# EAGLE schematic v1.7 (EAGLE 9.6.2)
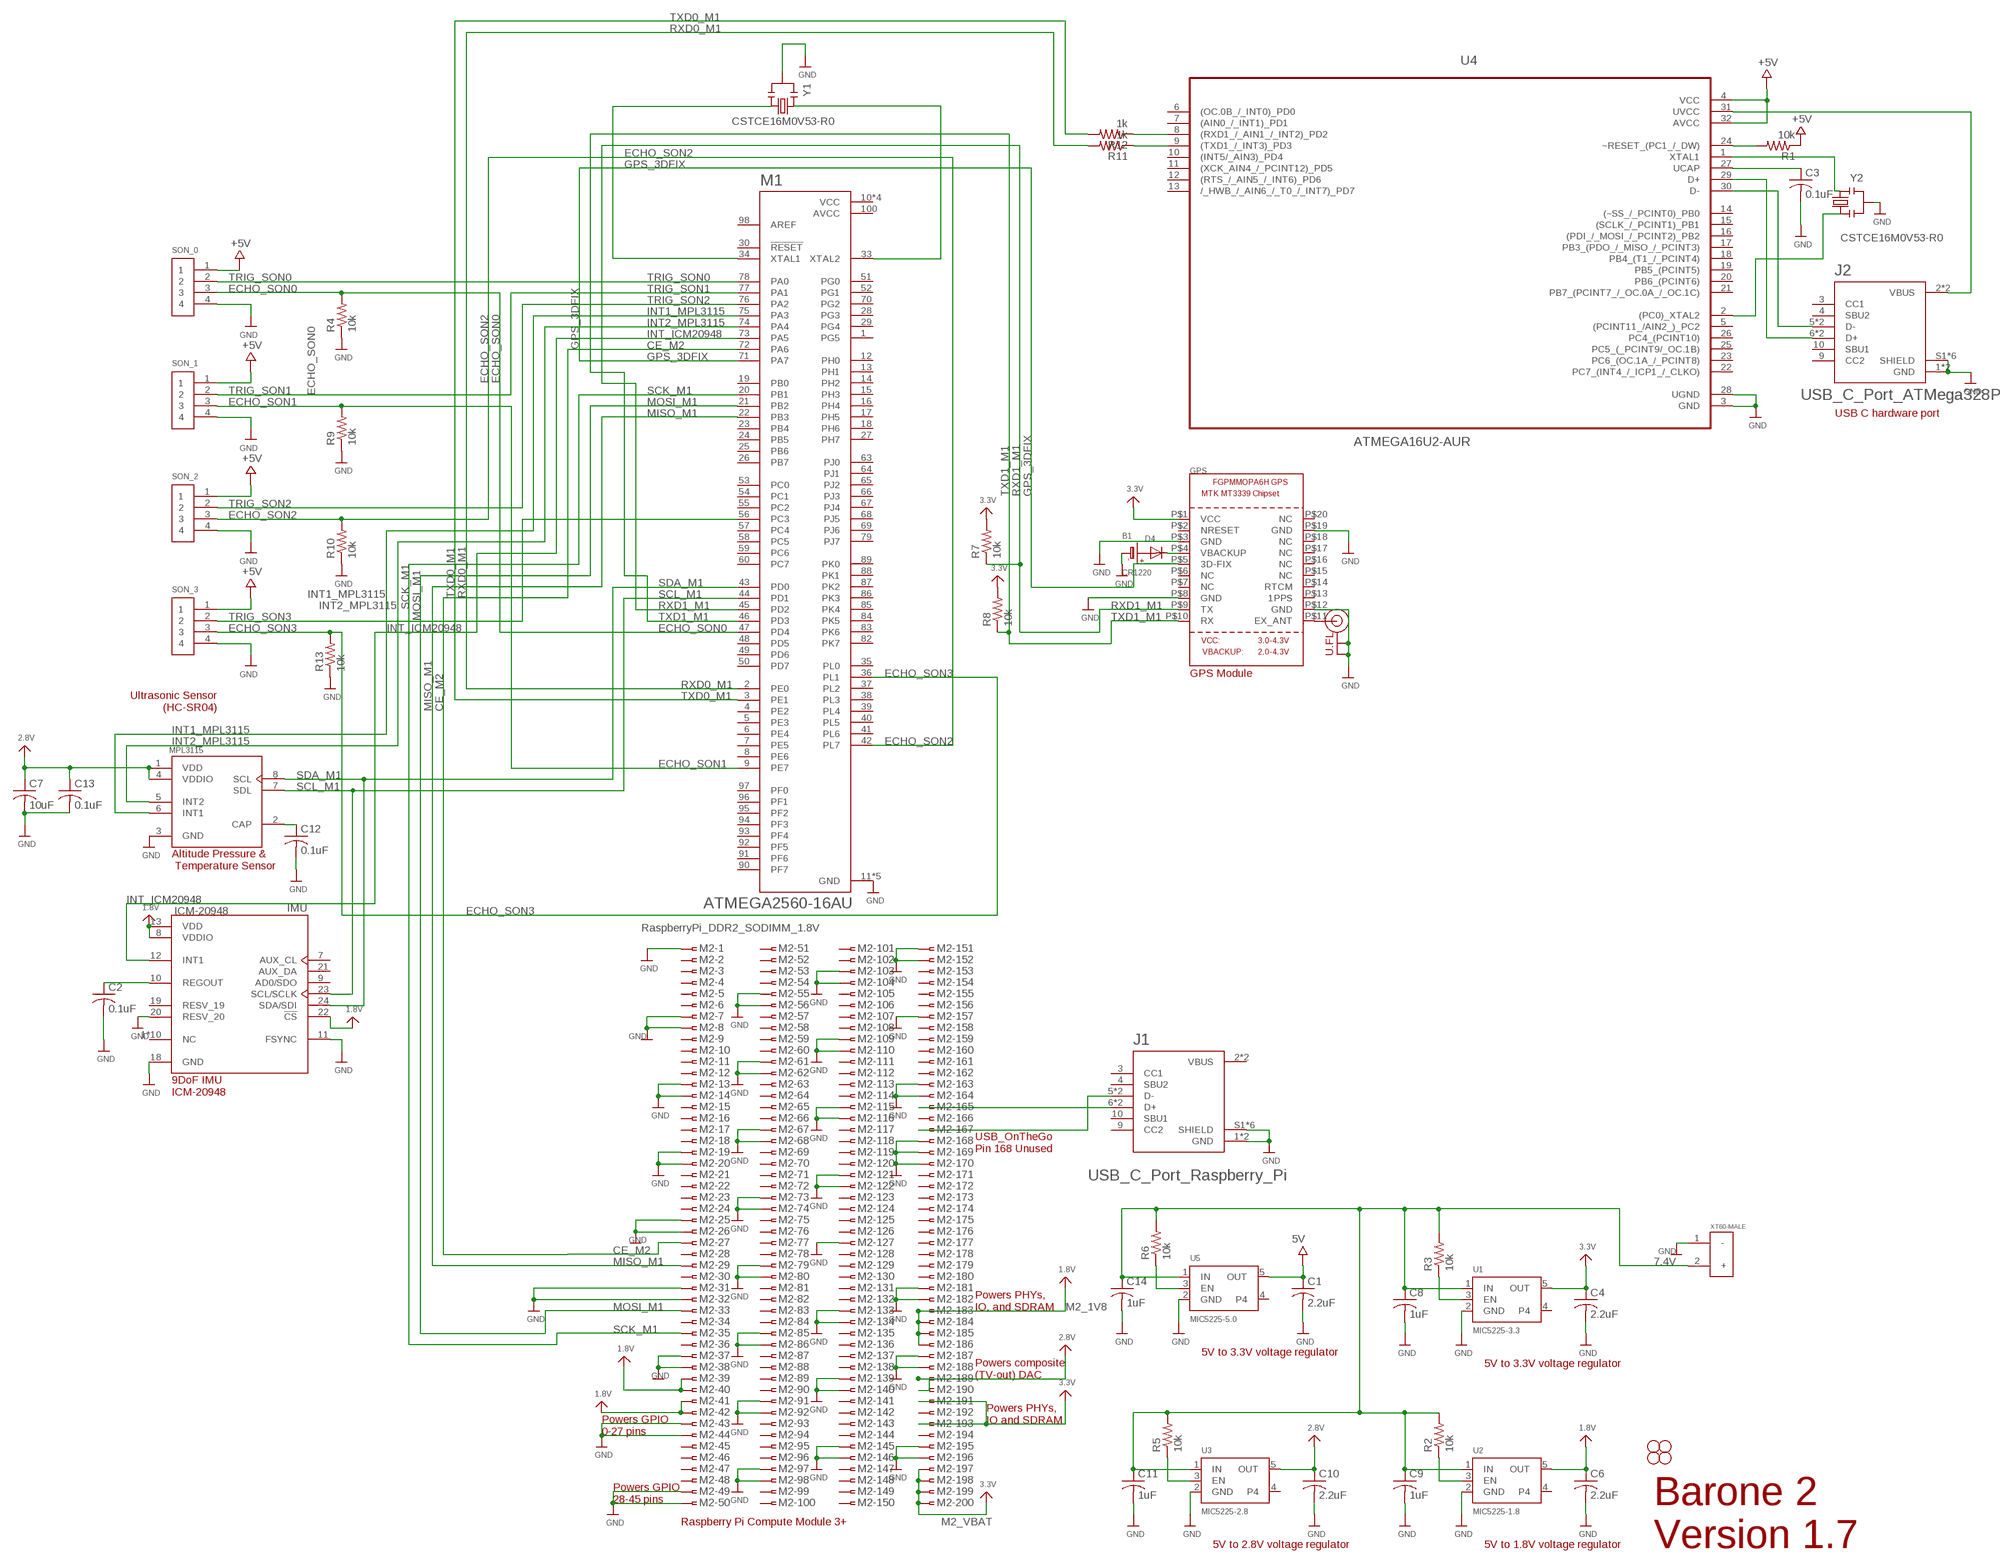
[diagram p0: schematic, sheet 1]

## Parts
B1  CR1220  BATTERYCR1220_SMT  [CR1220]
C1  2.2uF  C-USC0805  [C0805]
C2  0.1uF  C-USC0805  [C0805]
C3  0.1uF  C-USC0805  [C0805]
C4  2.2uF  C-USC0805  [C0805]
C6  2.2uF  C-USC0805  [C0805]
C7  10uF  C-USC0805  [C0805]
C8  1uF  C-USC0805  [C0805]
C9  1uF  C-USC0805  [C0805]
C10  2.2uF  C-USC0805  [C0805]
C11  1uF  C-USC0805  [C0805]
C12  0.1uF  C-USC0805  [C0805]
C13  0.1uF  C-USC0805  [C0805]
C14  1uF  C-USC0805  [C0805]
D4  DIODESOD-323F  [SOD-323F]
GPS  GPS_FGPMMOPA6H  [FGPMMOPA6H]
H1  STAND-OFF  [STAND-OFF]
H2  STAND-OFF  [STAND-OFF]
H3  STAND-OFF  [STAND-OFF]
H4  STAND-OFF  [STAND-OFF]
IMU  ICM-20948  [QFN40P300X300X105-24N]
J1  USB_C_Port_Raspberry_Pi  DX07S016JA1R1500  [JAE_DX07S016JA1R1500]
J2  USB_C_Port_ATMega328P  DX07S016JA1R1500  [JAE_DX07S016JA1R1500]
M1  ATMEGA2560-16AU  [QFP50P1600X1600X120-100N]
M2  RaspberryPi_DDR2_SODIMM_1.8V  1376408-SLOT_1.8V  [SLOT-1376408-1_1.8V]
MPL3115  MPL3115A2  [PSON125P300X500X120-8N]
R1  10k  R-US_R0805W  [R0805W]
R2  10k  R-US_R0805W  [R0805W]
R3  10k  R-US_R0805W  [R0805W]
R4  10k  R-US_R0805W  [R0805W]
R5  10k  R-US_R0805W  [R0805W]
R6  10k  R-US_R0805W  [R0805W]
R7  10k  R-US_R0805W  [R0805W]
R8  10k  R-US_R0805W  [R0805W]
R9  10k  R-US_R0805W  [R0805W]
R10  10k  R-US_R0805W  [R0805W]
R11  1k  R-US_R0805W  [R0805W]
R12  1k  R-US_R0805W  [R0805W]
R13  10k  R-US_R0805W  [R0805W]
SON_0  1X4-BIG  [1X04-BIG]
SON_1  1X4-BIG  [1X04-BIG]
SON_2  1X4-BIG  [1X04-BIG]
SON_3  1X4-BIG  [1X04-BIG]
U1  MIC5225-3.3  VREG_SOT23-5  [SOT23-5]
U2  MIC5225-1.8  VREG_SOT23-5  [SOT23-5]
U3  MIC5225-2.8  VREG_SOT23-5  [SOT23-5]
U4  ATMEGA16U2-AUR  [QFP80P900X900X120-32N]
U5  MIC5225-5.0  VREG_SOT23-5  [SOT23-5]
U.FL  U.FL  [U.FL]
XT60-MALE  XT60-M  [AMASS_XT60-M]
Y1  CSTCE16M0V53-R0  0011_CSTCE16M0V53-R0  [RESONATOR]
Y2  CSTCE16M0V53-R0  0011_CSTCE16M0V53-R0  [RESONATOR]

## Nets
7.4V: C8.1 C9.1 C11.1 C14.1 R2.2 R3.2 R5.2 R6.2 U1.1(IN) U2.1(IN) U3.1(IN) U5.1(IN) XT60-MALE.2(+)
+5V: R1.1 SON_0.1 SON_1.1 SON_2.1 SON_3.1 U4.4(VCC) U4.32(AVCC)
CE_M2: M1.72(PA6) M2.27
ECHO_SON0: M1.47(PD4) R4.2 SON_0.3
ECHO_SON1: M1.9(PE7) R9.2 SON_1.3
ECHO_SON2: M1.42(PL7) R10.2 SON_2.3
ECHO_SON3: M1.36(PL1) R13.2 SON_3.3
GND: B1.- C1.2 C2.2 C3.2 C4.2 C6.2 C7.2 C8.2 C9.2 C10.2 C11.2 C12.2 C13.2 C14.2 GPS.P$3(GND) GPS.P$8(GND) GPS.P$19(GND) IMU.11(FSYNC) IMU.18(GND) IMU.20(RESV_20) J1.1(GND) J1.12(GND) J1.S1(SHIELD) J1.S2(SHIELD) J1.S3(SHIELD) J1.S4(SHIELD) J1.S5(SHIELD) J1.S6(SHIELD) J2.1(GND) J2.12(GND) J2.S1(SHIELD) J2.S2(SHIELD) J2.S3(SHIELD) J2.S4(SHIELD) J2.S5(SHIELD) J2.S6(SHIELD) M1.11(GND) M1.32(GND) M1.62(GND) M1.81(GND) M1.99(GND) M2.1 M2.7 M2.8 M2.13 M2.14 M2.19 M2.20 M2.25 M2.26 M2.31 M2.32 M2.37 M2.38 M2.43 M2.44 M2.49 M2.50 M2.55 M2.56 M2.61 M2.62 M2.67 M2.68 M2.73 M2.74 M2.79 M2.80 M2.85 M2.86 M2.91 M2.92 M2.97 M2.98 M2.103 M2.104 M2.109 M2.110 M2.115 M2.116 M2.121 M2.122 M2.127 M2.133 M2.134 M2.139 M2.140 M2.145 M2.146 M2.151 M2.152 M2.157 M2.163 M2.164 M2.168 M2.169 M2.170 M2.181 M2.182 M2.187 M2.188 M2.195 M2.196 MPL3115.3(GND) R4.1 R9.1 R10.1 R13.1 SON_0.4 SON_1.4 SON_2.4 SON_3.4 U1.2(GND) U2.2(GND) U3.2(GND) U4.3(GND) U4.28(UGND) U5.2(GND) XT60-MALE.1(-) Y1.2 Y2.2
GPS_3DFIX: GPS.P$5(3D-FIX) M1.71(PA7)
INT1_MPL3115: M1.75(PA3) MPL3115.6(INT1)
INT2_MPL3115: M1.74(PA4) MPL3115.5(INT2)
INT_ICM20948: IMU.12(INT1) M1.73(PA5)
M2_1V8: M2.183 M2.184 M2.185 M2.186 ; supply symbol labelled 1.8V
M2_VBAT: M2.197 M2.198 M2.199 M2.200 ; supply symbol labelled 3.3V
MISO_M1: M1.22(PB3) M2.29
MOSI_M1: M1.21(PB2) M2.33
N$1: M1.34(XTAL1) Y1.3
N$2: GPS.P$12(GND) U.FL.P$1(GND) U.FL.P$2(GND) ; supply symbol labelled GND
N$3: GPS.P$11(EX_ANT) U.FL.P$3(SIGNAL)
N$4: R3.1 U1.3(EN)
N$5: B1.+$1(+) B1.+$2(+) D4.A
N$6: R2.1 U2.3(EN)
N$7: J1.6(D+) J1.7(D+) M2.165
N$8: J1.5(D-) J1.8(D-) M2.167
N$9: M2.39 M2.40 ; supply symbol labelled 1.8V
N$10: C12.1 MPL3115.2(CAP)
N$11: R6.1 U5.3(EN)
N$12: R5.1 U3.3(EN)
N$13: M1.33(XTAL2) Y1.1
N$14: U4.1(XTAL1) Y2.1
N$15: M2.41 M2.42 ; supply symbol labelled 1.8V
N$17: U4.2((PC0)_XTAL2) Y2.3
N$18: J2.5(D-) J2.8(D-) U4.30(D-)
N$21: D4.C GPS.P$4(VBACKUP)
N$22: J2.6(D+) J2.7(D+) U4.29(D+)
N$23: J2.2(VBUS) J2.11(VBUS) U4.31(UVCC)
N$24: R11.1 U4.9((TXD1_/_INT3)_PD3)
N$25: R12.1 U4.8((RXD1_/_AIN1_/_INT2)_PD2)
N$26: R1.2 U4.24(~RESET_(PC1_/_DW))
N$27: C3.1 U4.27(UCAP)
N$32: C2.1 IMU.10(REGOUT)
OUT: C1.1 C4.1 C6.1 C10.1 U1.5(OUT) U2.5(OUT) U3.5(OUT) U5.5(OUT) ; supply symbol labelled 3.3V, 1.8V, 2.8V, 5V
RXD0_M1: M1.2(PE0) R11.2
RXD1_M1: GPS.P$9(TX) M1.45(PD2) R7.1
SCK_M1: M1.20(PB1) M2.35
SCL_M1: IMU.23(SCL/SCLK) M1.44(PD1) MPL3115.7(SDL)
SDA_M1: IMU.24(SDA/SDI) M1.43(PD0) MPL3115.8(SCL)
TRIG_SON0: M1.78(PA0) SON_0.2
TRIG_SON1: M1.77(PA1) SON_1.2
TRIG_SON2: M1.76(PA2) SON_2.2
TRIG_SON3: M1.56(PC3) SON_3.2
TXD0_M1: M1.3(PE1) R12.2
TXD1_M1: GPS.P$10(RX) M1.46(PD3) R8.1
VIN: C7.1 C13.1 GPS.P$1(VCC) IMU.8(VDDIO) IMU.13(VDD) IMU.22(!CS) M2.189 M2.190 M2.191 M2.193 MPL3115.1(VDD) MPL3115.4(VDDIO) R7.2 R8.2 ; supply symbol labelled 2.8V, 3.3V, 1.8V
Unconnected: GPS.P$2(NRESET) GPS.P$6(NC) GPS.P$7(NC) GPS.P$13(1PPS) GPS.P$14(RTCM) GPS.P$15(NC) GPS.P$16(NC) GPS.P$17(NC) GPS.P$18(NC) GPS.P$20(NC) IMU.1(NC) IMU.2(NC) IMU.3(NC) IMU.4(NC) IMU.5(NC) IMU.6(NC) IMU.7(AUX_CL) IMU.9(AD0/SDO) IMU.14(NC) IMU.15(NC) IMU.16(NC) IMU.17(NC) IMU.19(RESV_19) IMU.21(AUX_DA) J1.3(CC1) J1.4(SBU2) J1.9(CC2) J1.10(SBU1) J2.3(CC1) J2.4(SBU2) J2.9(CC2) J2.10(SBU1) M1.1(PG5) M1.4(PE2) M1.5(PE3) M1.6(PE4) M1.7(PE5) M1.8(PE6) M1.12(PH0) M1.13(PH1) M1.14(PH2) M1.15(PH3) M1.16(PH4) M1.17(PH5) M1.18(PH6) M1.19(PB0) M1.23(PB4) M1.24(PB5) M1.25(PB6) M1.26(PB7) M1.27(PH7) M1.28(PG3) M1.29(PG4) M1.30(!RESET) M1.35(PL0) M1.37(PL2) M1.38(PL3) M1.39(PL4) M1.40(PL5) M1.41(PL6) M1.48(PD5) M1.49(PD6) M1.50(PD7) M1.51(PG0) M1.52(PG1) M1.53(PC0) M1.54(PC1) M1.55(PC2) M1.57(PC4) M1.58(PC5) M1.59(PC6) M1.60(PC7) M1.63(PJ0) M1.64(PJ1) M1.65(PJ2) M1.66(PJ3) M1.67(PJ4) M1.68(PJ5) M1.69(PJ6) M1.70(PG2) M1.79(PJ7) M1.82(PK7) M1.83(PK6) M1.84(PK5) M1.85(PK4) M1.86(PK3) M1.87(PK2) M1.88(PK1) M1.89(PK0) M1.90(PF7) M1.91(PF6) M1.92(PF5) M1.93(PF4) M1.94(PF3) M1.95(PF2) M1.96(PF1) M1.97(PF0) M1.98(AREF) M2.2 M2.3 M2.4 M2.5 M2.6 M2.9 M2.10 M2.11 M2.12 M2.15 M2.16 M2.17 M2.18 M2.21 M2.22 M2.23 M2.24 M2.28 M2.30 M2.34 M2.36 M2.45 M2.46 M2.47 M2.48 M2.51 M2.52 M2.53 M2.54 M2.57 M2.58 M2.59 M2.60 M2.63 M2.64 M2.65 M2.66 M2.69 M2.70 M2.71 M2.72 M2.75 M2.76 M2.77 M2.78 M2.81 M2.82 M2.83 M2.84 M2.87 M2.88 M2.89 M2.90 M2.93 M2.94 M2.95 M2.96 M2.99 M2.100 M2.101 M2.102 M2.105 M2.106 M2.107 M2.108 M2.111 M2.112 M2.113 M2.114 M2.117 M2.118 M2.119 M2.120 M2.123 M2.124 M2.125 M2.126 M2.128 M2.129 M2.130 M2.131 M2.132 M2.135 M2.136 M2.137 M2.138 M2.141 M2.142 M2.143 M2.144 M2.147 M2.148 M2.149 M2.150 M2.153 M2.154 M2.155 M2.156 M2.158 M2.159 M2.160 M2.161 M2.162 M2.166 M2.171 M2.172 M2.173 M2.174 M2.175 M2.176 M2.177 M2.178 M2.179 M2.180 M2.192 M2.194 U1.4 U2.4 U3.4 U4.5((PCINT11_/AIN2_)_PC2) U4.6((OC.0B_/_INT0)_PD0) U4.7((AIN0_/_INT1)_PD1) U4.10((INT5/_AIN3)_PD4) U4.11((XCK_AIN4_/_PCINT12)_PD5) U4.12((RTS_/_AIN5_/_INT6)_PD6) U4.13(/_HWB_/_AIN6_/_T0_/_INT7)_PD7) U4.14((~SS_/_PCINT0)_PB0) U4.15((SCLK_/_PCINT1)_PB1) U4.16((PDI_/_MOSI_/_PCINT2)_PB2) U4.17(PB3_(PDO_/_MISO_/_PCINT3)) U4.18(PB4_(T1_/_PCINT4)) U4.19(PB5_(PCINT5)) U4.20(PB6_(PCINT6)) U4.21(PB7_(PCINT7_/_OC.0A_/_OC.1C)) U4.22(PC7_(INT4_/_ICP1_/_CLKO)) U4.23(PC6_(OC.1A_/_PCINT8)) U4.25(PC5_(_PCINT9/_OC.1B)) U4.26(PC4_(PCINT10)) U5.4

## Notes on the sheet
- USB C hardware port
- U.FL
- GPS Module
- Ultrasonic Sensor
  (HC-SR04)
- Altitude Pressure &
   Temperature Sensor
- 9DoF IMU
  ICM-20948
- USB_OnTheGo
  Pin 168 Unused
- Powers PHYs, 
  IO, and SDRAM
- 5V to 3.3V voltage regulator
- 5V to 3.3V voltage regulator
- Powers composite
  (TV-out) DAC
- Powers PHYs, 
  IO and SDRAM
- Powers GPIO 
  0-27 pins
- Powers GPIO 
  28-45 pins
- Raspberry Pi Compute Module 3+
- 5V to 2.8V voltage regulator | 5V to 1.8V voltage regulator
- Barone 2
  Version 1.7

## Power pins joined to a net without a drawn wire
AVCC: M1.100(AVCC)
VBUS: J1.2(VBUS) J1.11(VBUS)
VCC: M1.10(VCC) M1.31(VCC) M1.61(VCC) M1.80(VCC)

## Library data of the parts
B1 = microbuilder:BATTERY: CR1220 SMT - Digikey: 3001K-ND CD2032 BAT-HLD-001 - Digikey: BAT-HLD-001-ND
C1-C4 C6-C14 = rcl:C-US: CAPACITOR, American symbol; SPICEPREFIX: C
D4 = adafruit:DIODE: Diode SMADIODE - SMA Surface Mount Package 20V 1A Schottky Diode Digikey: 641-1014-6-ND DO-1N4148 - Through Hole Small Current Diode SOD-123 20V 1 A (.5mV Vf) Schottky Diode - Digikey: MBRX120TPMSCT-ND SOD-323 10V 570mA (.38mV Vf, 3ns) Schottky Diode - Digikey: ZLLS410CT-ND SOD-523 30V 30mA Schottky Diode (RB751S-40TE61) - Digikey: RB751S-40TE61CT-ND SOT23-R/W - SOT23 Package (R = Solder Paste/Reflow Ovens, W = Hand-Soldering) BAT54Film 40V 300mA - Digikey: 497-7162-1-ND
GPS = adafruit:GPS_FGPMMOPA6H: GPS Module - MTK MT3339 Chipset, -165dBm sensitivity, 22 channels, 10Hz, auto-select external antenna options
H1-H4 = SparkFun-Hardware:STAND-OFF: Stand Off Drill holes for mechanically mounting via screws, standoffs, etc. Note: Use the keepout ring to avoid running the screw head into surrounding components. Variant Overviews STAND-OFF - Mechanical footprint for a #4 phillips button head screw. STAND-OFF-TIGHT - Mechanical footprint for a #4 phillips button head screw, Example SparkFun Products Screw - Phillips Head (1/4", 4-40, 10 pack) <https://www.sparkfun.com/products/10453> (PRT-10453) Screw - Phillips Head (1/2", 4-40, 10 pack) <https://www.sparkfun.com/products/10452> (PRT-10452) Screw - Phillips Head (3/4", 4-40, 10 pack) <https://www.sparkfun.com/products/10451> (PRT-10451) Screw - Phillips Head (1", 4-40, 10 pack) <https://www.sparkfun.com/products/10450> (PRT-10450)
IMU = ICM-20948:ICM-20948: Accelerometer, Gyroscope, Magnetometer, 9 Axis Sensor I²C, SPI Output Check prices <https://pricing.snapeda.com/parts/ICM-20948/TDK%20InvenSense/view-part?ref=eda>; AVAILABILITY: Good; DESCRIPTION: Accelerometer, Gyroscope, Magnetometer, 9 Axis Sensor I²C, SPI Output; MF: TDK InvenSense; MP: ICM-20948; PACKAGE: TFQFN-24 TDK InvenSense; PRICE: None; PURCHASE-URL: https://pricing.snapeda.com/search/part/ICM-20948/?ref=eda
J1 J2 = DX07S016JA1R1500:DX07S016JA1R1500: USB-C (USB TYPE-C) USB 2.0 Receptacle Connector 24 (16+8 Dummy) Position Surface Mount, Right Angle; Through Hole Check prices <https://pricing.snapeda.com/parts/DX07S016JA1R1500/JAE%20Electronics/view-part?ref=eda>; AVAILABILITY: Warning; DESCRIPTION: USB-C (USB TYPE-C) USB 2.0 Receptacle Connector 24 (16+8 Dummy) Position Surface Mount, Right Angle; Through Hole; MF: JAE Electronics; MP: DX07S016JA1R1500; PACKAGE: None; PRICE: None; PURCHASE-URL: https://pricing.snapeda.com/search/part/DX07S016JA1R1500/?ref=eda
M1 = ATMEGA2560-16AU:ATMEGA2560-16AU: ATmega Series 16 MHz 256 KB Flash 8 KB SRAM 8-Bit Microcontroller - TQFP-100 Check prices <https://pricing.snapeda.com/parts/ATMEGA2560-16AU/Microchip/view-part?ref=eda>; AVAILABILITY: Good; DESCRIPTION: AVR AVR® ATmega Microcontroller IC 8-Bit 16MHz 256KB (128K x 16) FLASH 100-TQFP (14x14); MF: Microchip; MP: ATMEGA2560-16AU; PACKAGE: TQFP-100 Microchip; PRICE: None; PURCHASE-URL: https://pricing.snapeda.com/search/part/ATMEGA2560-16AU/?ref=eda
M2 = con-amp:1376408: DDR1 & DDR2 SODIMM SOCKET 0.6mm Pitch 200 Pos. Standard Profile, Standard Type (used on Kontron X-Board) Source: http://catalog.tycoelectronics.com .. JPN_CD_1376408_S.pdf
MPL3115 = MPL3115A2:MPL3115A2: Pressure Sensor, 50-110kpa, Lga-8 Check prices <https://pricing.snapeda.com/parts/MPL3115A2/NXP%20Semiconductors/view-part?ref=eda>; AVAILABILITY: Good; DESCRIPTION: Pressure Sensor 7.25PSI ~ 15.95PSI (50kPa ~ 110kPa) Absolute 24 b 8-TLGA; MF: NXP Semiconductors; MP: MPL3115A2; PACKAGE: TLGA-8 NXP Semiconductors; PRICE: None; PURCHASE-URL: https://pricing.snapeda.com/search/part/MPL3115A2/?ref=eda
R1-R13 = adafruit:R-US_: RESISTOR, American symbol
SON_0 SON_1-SON_3 = adafruit:1X4: 4-pin connector
U1-U3 U5 = microbuilder:VREG_SOT23-5: SOT23-5 Fixed Voltage Regulators Part Current Out V Out V In V Dropout θJA (°C/W) TJ (°C) Digikey Part No. ADP121 150mA 3.3V 3.4-5.5V 0.09V @ 150mA -- -- ADP121-AUJZ33R7CT-ND ADP121 150mA 3.0V 3.1-5.5V 0.09V @ 150mA -- -- ADP121-AUJZ30R7CT-ND ADP122 300mA 3.3V 3.4-5.5V 0.085V @ 300mA -- -- ADP122AUJZ-3.3-R7CT-ND ADP1712 300mA 3.3V 3.5-5.5V 0.17V @ 300mA -- -- ADP1712AUJZ-3.3-R7TR-ND AP7311 (Low Cost) 150mA 3.3V 3.5-6V 0.15V @ 150mA -- -- AP7311-33WG-7DICT-ND LD39015M18R 150mA 1.8V 1.9V-5.5V 0.08V @ 100mA -- -- 497-6977-1-ND LP2985A-33DBVR 150mA 3.3V 3.3-16V 0.28V @ 150mA 206 150 296-18479-1-ND MCP1824T-3302E/OT 300mA 3.3V 3.5V-6V 0.2V @ 300mA -- -- MCP1824T-3302E/OTCT-ND MIC5205-2.5YM5 TR 150mA 2.5V 2.7-16V 0.165V @ 150mA -- -- 576-1257-2-ND MIC5205-3.0YM5 TR 150mA 3.0V 3.2V-16V 0.165V @ 150mA -- -- 576-1258-2-ND MIC5205-3.3YM5 TR 150mA 3.3V 3.5V-16V 0.165V @ 150mA -- -- 576-1259-2-ND TPS780330220 150mA 3.3V+2.2V 3.6-5.5V 250mV Max -- -- 296-23332-1-ND TDA3663/N1,135 100mA 3.3V 3.5-45V 0.18V @ 50mA -- -- 568-5343-1-ND Max operating temp can be calculated using θJA, TJ (max junction temperature), and power in watts. Set the "Maximum Ambient Temperature" until it reaches TJ ("Max Junction Temperature"), which is the absolute limit for safe use of the regulator: Heat Sink Temperature Calculator <http://www.daycounter.com/Calculators/Heat-Sink-Temperature-Calculator.phtml> For example, With 12V source into a 3.3V LP2985 and a 30mA load, we are dissipating (12V-3.3V) * 0.03A = 0.261W. With a θJA of 206 °C/W, a TJ of 150°C, and 261mW we can safely use the chip without a heat sink up to 75°C (=147.1°C Junction Temperature).
U4 = ATMEGA16U2-AUR:ATMEGA16U2-AUR: 8-bit Microcontroller Check prices <https://pricing.snapeda.com/parts/ATMEGA16U2-AUR/Microchip/view-part?ref=eda>; AVAILABILITY: Good; DESCRIPTION: AVR AVR® ATmega Microcontroller IC 8-Bit 16MHz 16KB (8K x 16) FLASH 32-TQFP (7x7); MF: Microchip; MP: ATMEGA16U2-AUR; PACKAGE: TQFP-32 Microchip; PRICE: None; PURCHASE-URL: https://pricing.snapeda.com/search/part/ATMEGA16U2-AUR/?ref=eda
U.FL = microbuilder:U.FL: U.FL Antenna Connector
XT60-MALE = XT60-M:XT60-M: DC supply; XT60; male; PIN:2; for cable; soldered; 60A; 500V; AVAILABILITY: Unavailable; DESCRIPTION: Plug; DC supply; XT60; male; PIN: 2; for cable; soldered; 30A; 500V; MF: AMASS; MP: XT60-M; PACKAGE: Package; PRICE: None
Y1 Y2 = Cristalli:0011_CSTCE16M0V53-R0: 16Mhz - SMD; MONTHLY_USAGE: _____; PART_NUMBER: CSTCE16M0V53-R0; PRICE: _____; SUPPLIER: _____; TYPE: Cristalli